# EAGLE design lc3dimmer_comm12V (EAGLE 5.04)
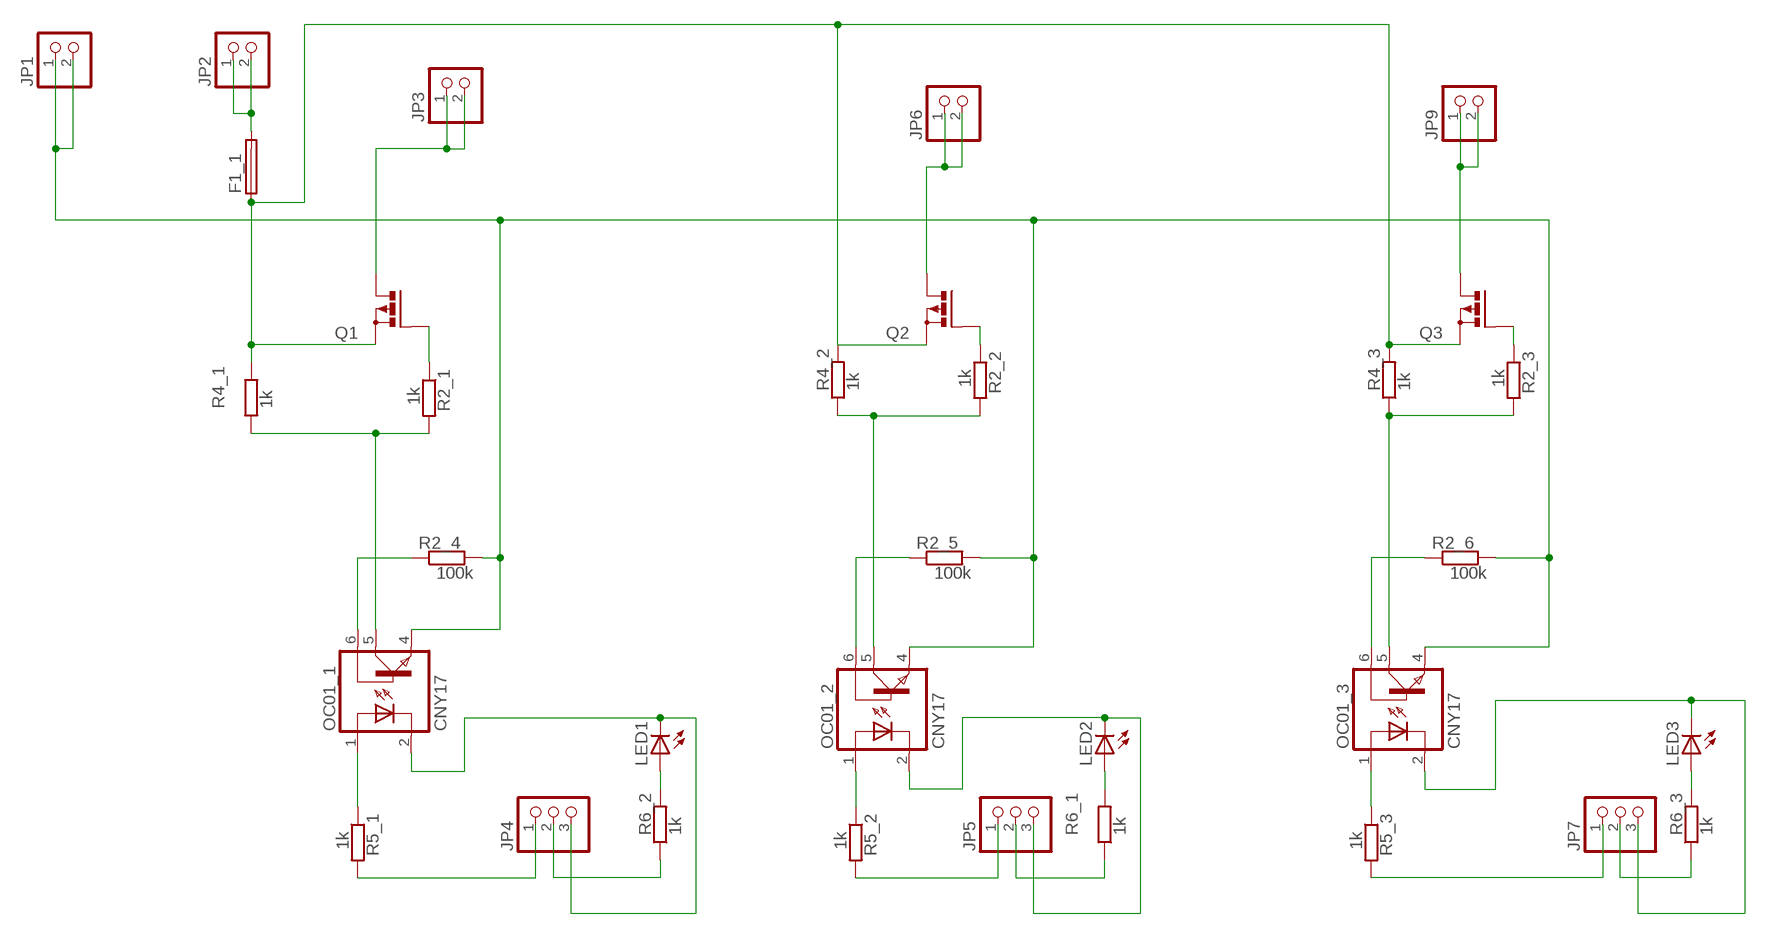
[diagram p0: schematic, sheet 1]

## Parts
F1_1  F457REICHELT  [PTF50]
JP1  PINHD-1X2  [1X02]
JP2  PINHD-1X2  [1X02]
JP3  PINHD-1X2  [1X02]
JP4  PINHD-1X3  [1X03]
JP5  PINHD-1X3  [1X03]
JP6  PINHD-1X2  [1X02]
JP7  PINHD-1X3  [1X03]
JP9  PINHD-1X2  [1X02]
LED1  LED3MM  [LED3MM]
LED2  LED3MM  [LED3MM]
LED3  LED3MM  [LED3MM]
OC01_1  CNY17  [DIL06]
OC01_2  CNY17  [DIL06]
OC01_3  CNY17  [DIL06]
Q1  PMOSFET_PTO220BV  [TO220BV]
Q2  PMOSFET_PTO220BV  [TO220BV]
Q3  PMOSFET_PTO220BV  [TO220BV]
R2_1  1k  R-EU_0207/10  [0207/10]
R2_2  1k  R-EU_0207/10  [0207/10]
R2_3  1k  R-EU_0207/10  [0207/10]
R2_4  100k  R-EU_0207/10  [0207/10]
R2_5  100k  R-EU_0207/10  [0207/10]
R2_6  100k  R-EU_0207/10  [0207/10]
R4_1  1k  R-EU_0207/10  [0207/10]
R4_2  1k  R-EU_0207/10  [0207/10]
R4_3  1k  R-EU_0207/10  [0207/10]
R5_1  1k  R-EU_R1206  [R1206]
R5_2  1k  R-EU_R1206  [R1206]
R5_3  1k  R-EU_R1206  [R1206]
R6_1  1k  R-EU_R1206  [R1206]
R6_2  1k  R-EU_R1206  [R1206]
R6_3  1k  R-EU_R1206  [R1206]

## Nets
12V+: F1_1.2 JP2.1 JP2.2
DIMMGND: JP3.1 JP3.2 Q1.D
GND: JP7.3 LED3.K(C) OC01_3.2(C)
LED+: F1_1.1 Q1.S Q2.S Q3.S R4_1.2 R4_2.2 R4_3.2
LED-: JP1.1 JP1.2 OC01_1.4(EMI) OC01_2.4(EMI) OC01_3.4(EMI) R2_4.2 R2_5.2 R2_6.2
N$1: OC01_1.6(BAS) R2_4.1
N$2: OC01_2.5(COL) R2_2.2 R4_2.1
N$3: OC01_1.5(COL) R2_1.2 R4_1.1
N$4: OC01_2.1(A) R5_2.1
N$5: Q1.G R2_1.1
N$6: Q2.G R2_2.1
N$7: OC01_3.5(COL) R2_3.2 R4_3.1
N$8: Q3.G R2_3.1
N$9: OC01_2.6(BAS) R2_5.1
N$10: OC01_3.6(BAS) R2_6.1
N$12: JP6.1 JP6.2 Q2.D
N$14: OC01_3.1(A) R5_3.1
N$23: JP9.1 JP9.2 Q3.D
N$24: LED1.A R6_2.2
N$25: LED2.A R6_1.2
N$26: JP4.2 R6_2.1
N$27: LED3.A R6_3.2
N$28: JP4.1 R5_1.2
N$29: JP5.1 R5_2.2
N$30: JP7.2 R6_3.1
N$31: JP5.3 LED2.K(C) OC01_2.2(C)
N$32: JP5.2 R6_1.1
N$33: JP7.1 R5_3.2
N$34: JP4.3 LED1.K(C) OC01_1.2(C)
N$37: OC01_1.1(A) R5_1.1

## Library data of the parts
F1_1 = fuse:F457: FUSE HOLDER CS, Schukat
JP1-JP3 JP6 JP9 = pinhead:PINHD-1X2: PIN HEADER
JP4 JP5 JP7 = pinhead:PINHD-1X3: PIN HEADER
LED1-LED3 = led:LED: LED OSRAM: - CHIPLED LG R971, LG N971, LY N971, LG Q971, LY Q971, LO R971, LY R971 LH N974, LH R974 LS Q976, LO Q976, LY Q976 LO Q996 - Hyper CHIPLED LW Q18S LB Q993, LB Q99A, LB R99A - SideLED LS A670, LO A670, LY A670, LG A670, LP A670 LB A673, LV A673, LT A673, LW A673 LH A674 LY A675 LS A676, LA A676, LO A676, LY A676, LW A676 LS A679, LY A679, LG A679 - Hyper Micro SIDELED® LS Y876, LA Y876, LO Y876, LY Y876 LT Y87S - SmartLED LW L88C, LW L88S LB L89C, LB L89S, LG L890 LS L89K, LO L89K, LY L89K LS L896, LA L896, LO L896, LY L896 - TOPLED LS T670, LO T670, LY T670, LG T670, LP T670 LSG T670, LSP T670, LSY T670, LOP T670, LYG T670 LG T671, LOG T671, LSG T671 LB T673, LV T673, LT T673, LW T673 LH T674 LS T676, LA T676, LO T676, LY T676, LB T676, LH T676, LSB T676, LW T676 LB T67C, LV T67C, LT T67C, LS T67K, LO T67K, LY T67K, LW E67C LS E67B, LA E67B, LO E67B, LY E67B, LB E67C, LV E67C, LT E67C LW T67C LS T679, LY T679, LG T679 LS T770, LO T770, LY T770, LG T770, LP T770 LB T773, LV T773, LT T773, LW T773 LH T774 LS E675, LA E675, LY E675, LS T675 LS T776, LA T776, LO T776, LY T776, LB T776 LHGB T686 LT T68C, LB T68C - Hyper Mini TOPLED® LB M676 - Mini TOPLED Santana® LG M470 LS M47K, LO M47K, LY M47K Source: http://www.osram.convergy.de - LUMILED® LXK2-PW12-R00, LXK2-PW12-S00, LXK2-PW14-U00, LXK2-PW14-V00 LXK2-PM12-R00, LXK2-PM12-S00, LXK2-PM14-U00 LXK2-PE12-Q00, LXK2-PE12-R00, LXK2-PE12-S00, LXK2-PE14-T00, LXK2-PE14-U00 LXK2-PB12-K00, LXK2-PB12-L00, LXK2-PB12-M00, LXK2-PB14-N00, LXK2-PB14-P00, LXK2-PB14-Q00 LXK2-PR12-L00, LXK2-PR12-M00, LXK2-PR14-Q00, LXK2-PR14-R00 LXK2-PD12-Q00, LXK2-PD12-R00, LXK2-PD12-S00 LXK2-PH12-R00, LXK2-PH12-S00 LXK2-PL12-P00, LXK2-PL12-Q00, LXK2-PL12-R00 Source: www.luxeon.com
OC01_1-OC01_3 = optocoupler:CNY17: SIEMENS OPTO COUPLER
Q1-Q3 = transistor-power:PMOSFET_P: Power MOSFET P-Channel
R2_1-R2_6 R4_1-R4_3 R5_1-R5_3 R6_1-R6_3 = rcl:R-EU_: RESISTOR, European symbol

## Board
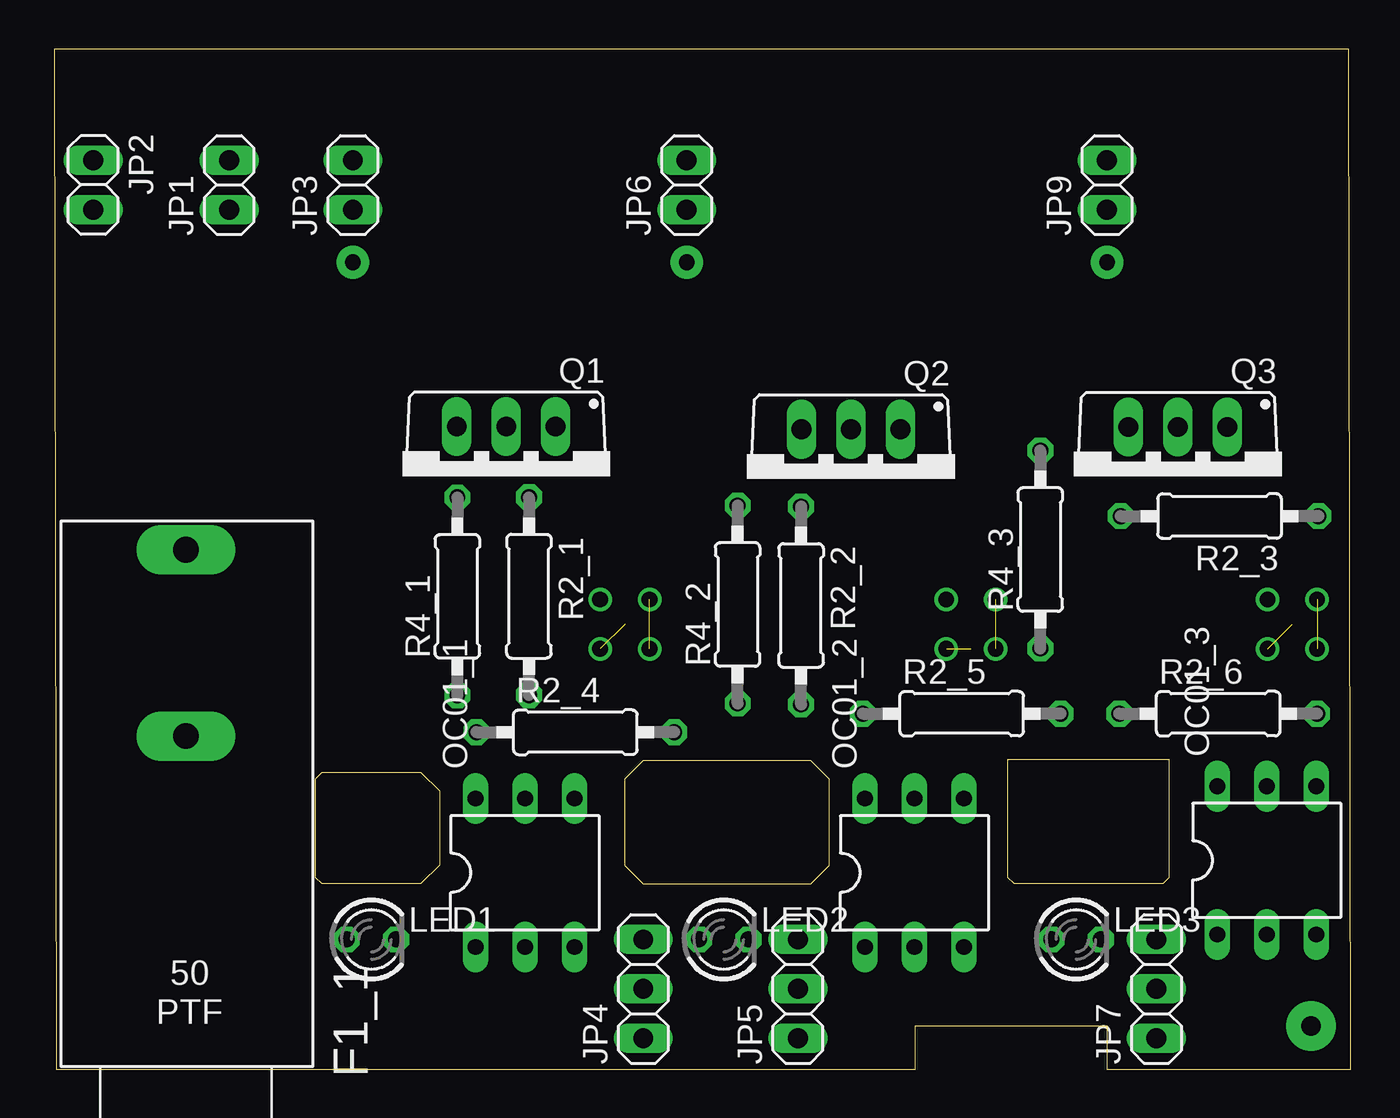
[diagram p1: board, top side]
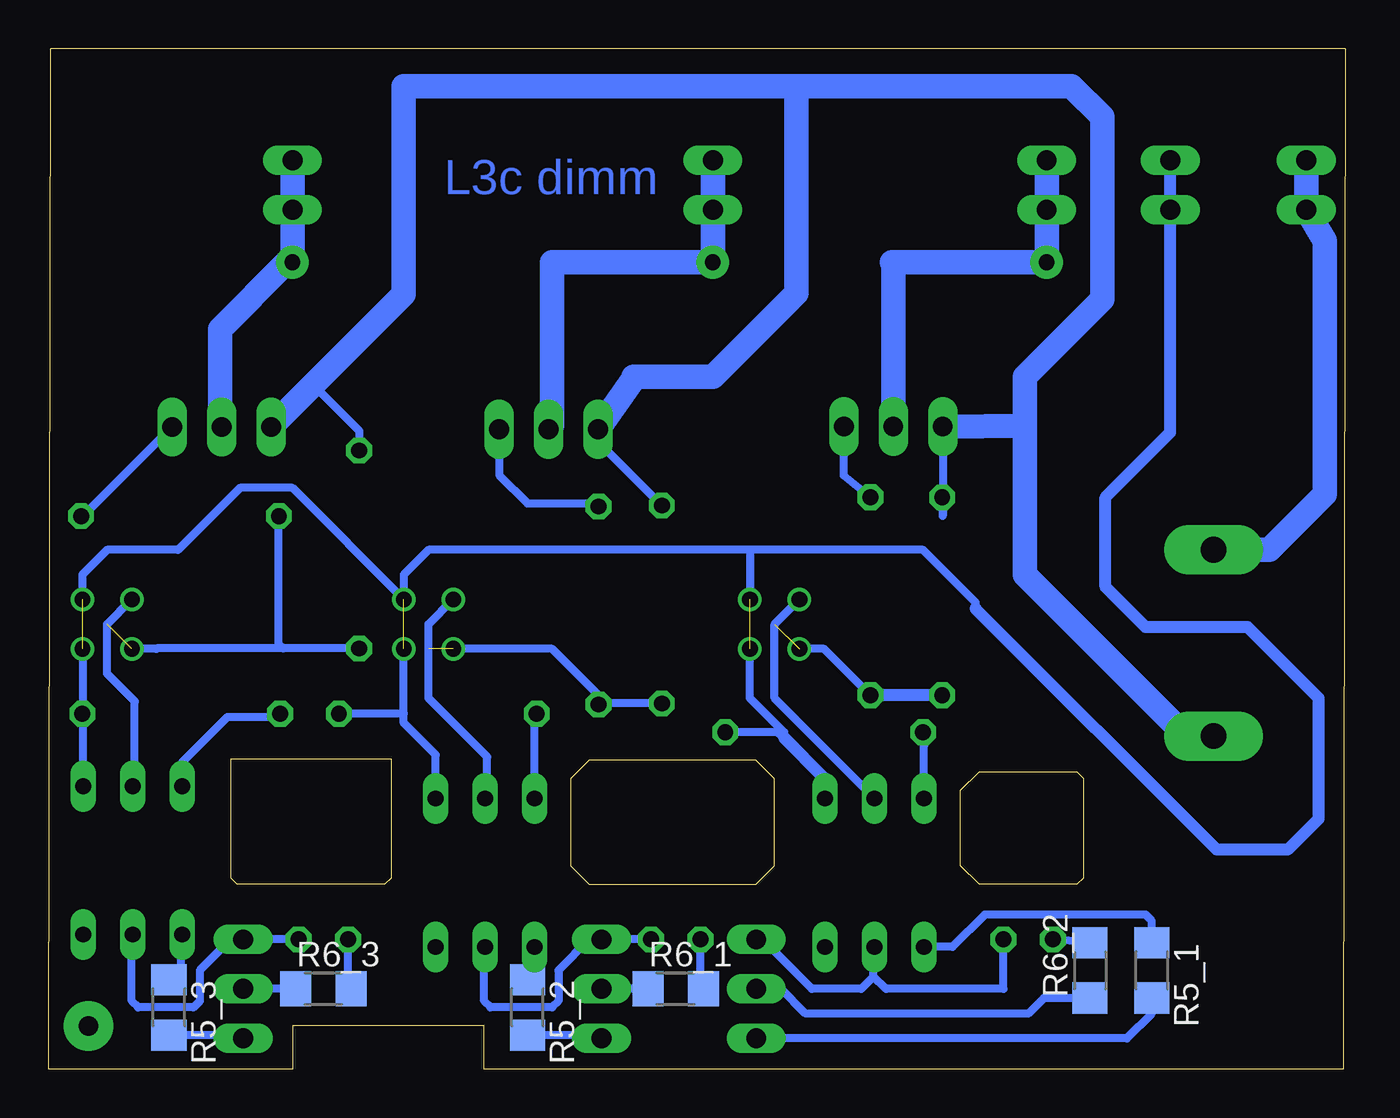
[diagram p2: board, bottom side, seen from below]

Size 66.6 x 52.4 mm. Coordinates in mm from the lower left corner, seen from the top.
Outline: 0.1,0 44.23,0 44.23,2.22 54.08,2.22 54.08,0 66.6,0 66.5,52.4 0,52.4 0.1,0
Outline: 49,9.84 49,15.91 57.25,15.91 57.25,9.84 56.93,9.53 49.31,9.53 49,9.84
Outline: 29.31,14.92 30.26,15.88 38.84,15.88 39.79,14.92 39.79,10.44 38.84,9.49 30.26,9.49 29.31,10.44 29.31,14.92
Outline: 13.75,15.24 18.83,15.24 19.79,14.29 19.79,10.48 18.83,9.53 13.75,9.53 13.44,9.84 13.44,14.92 13.75,15.24
Copper layers (1*16): Top 0.035mm / dielectric 1.5mm / Bottom 0.035mm
Design rules "default": minimum track width 10mil, minimum drill 24mil, track to track 8mil, track to pad 8mil, pad to pad 8mil, via to via 8mil, smd to smd 8mil, copper to edge 40mil, drill to drill 8mil, minimum pad ring 10mil, minimum via ring 8mil, stop-mask expansion 4mil, vias tented up to drill 0mil, thermal gap 10mil
bRestrict: area 4,37.4 to 7,40.4

### Footprints (pad centres in the part's own frame; a part is rotated, then mirrored left to right if it is on the bottom)
PTF50 = drill 1.321 pad 2.54 long: 1 -4.48,0; 2 5.08,0
1X02 = drill 1.016 long: 1 -1.27,0; 2 1.27,0
1X03 = drill 1.016 long: 1 -2.54,0; 2 0,0; 3 2.54,0
LED3MM = drill 0.813 octagon: A -1.27,0; K 1.27,0
DIL06 = drill 0.813 long: 1 -2.54,-3.81; 2 0,-3.81; 3 2.54,-3.81; 4 2.54,3.81; 5 0,3.81; 6 -2.54,3.81
TO220BV = drill 1.016 long: D 0,-2.54; G -2.54,-2.54; S 2.54,-2.54
0207/10 = drill 0.813 octagon: 1 -5.08,0; 2 5.08,0
R1206 = smd 1.6 x 1.803: 1 -1.422,0; 2 1.422,0

### Placement (x,y rotation side)
F1_1  6.77,21.59 90 top
JP1  8.99,45.4 90 top
JP2  2,45.4 270 top
JP3  15.34,45.4 90 top
JP4  30.26,4.13 90 top
JP5  38.2,4.13 90 top
JP6  32.48,45.4 90 top
JP7  56.62,4.13 90 top
JP9  54.08,45.4 90 top
LED1  16.29,6.67 0 top
LED2  34.39,6.67 0 top
LED3  52.49,6.67 0 top
OC01_1  24.18,10.09 0 top
OC01_2  44.19,10.09 0 top
OC01_3  62.28,10.73 0 top
Q1  23.22,30.46 180 top
Q2  40.92,30.32 180 top
Q3  57.72,30.44 180 top
R2_1  24.39,24.29 270 top
R2_2  38.36,23.81 270 top
R2_3  59.86,28.4 180 top
R2_4  26.77,17.3 0 top
R2_5  46.61,18.26 0 top
R2_6  59.79,18.26 0 top
R4_1  20.71,24.28 90 top
R4_2  35.1,23.86 90 top
R4_3  50.65,26.69 90 top
R5_1  9.94,5.08 270 bottom
R5_2  42.01,3.17 270 bottom
R5_3  60.43,3.17 270 bottom
R6_1  34.39,4.13 0 bottom
R6_2  13.12,5.08 90 bottom
R6_3  52.49,4.13 0 bottom

### Tracks (layer width: path | path; a pad name or v marks a point on that pad's centre or on a via)
12V+
  Bottom 1.27: F1_1.2 3.91,26.67 1.05,29.53 1.05,42.55 JP2.2 JP2.1
DIMMGND  (via drill 0.8 pad 1.68)
  Bottom 1.27: JP3.2 JP3.1 v15.34,41.43 23.22,41.43 | 23.22,41.43 23.28,41.43 | Q1.D 23.22,41.43
GND
  Bottom 0.406: LED3.K JP7.3 57.25,6.67 58.84,5.08 58.84,3.49 59.16,3.17 62.01,3.17 62.33,3.49 62.33,6.23 OC01_3.2
LED+
  Bottom 0.406: R4_1.2 20.68,28.41 Q1.S | Q2.S 38.38,32.22 R4_2.2 | R4_3.2 50.65,32.77 53.02,35.14
  Bottom 1.27: 28.2,50.32 28.2,39.85 | 28.2,50.32 28.2,50.48 48.36,50.48 48.36,39.8 53.02,35.14 Q3.S | 28.2,39.85 | 28.2,39.85 32.48,35.56 36.48,35.56 | 16.45,33.05 16.45,35.56 12.48,39.53 12.48,48.9 14.07,50.48 28.04,50.48 28.2,50.32 | F1_1.1 8.16,17.11 16.45,25.4 16.45,33.05 | 16.45,33.05 Q1.S | 36.48,35.56 36.55,35.56 | 36.48,35.56 Q2.S
LED-  (3 unrouted)
  Bottom 0.406: OC01_3.4 64.82,18.1 | 64.82,18.1 64.82,21.54 64.87,21.59 | 64.87,24.13 64.87,25.4 63.6,26.67 59.95,26.67 56.77,29.84 54.08,29.84 48.36,24.13 48.36,25.4 47.09,26.67 30.58,26.67 | OC01_2.4 46.73,16.14 48.36,17.78 48.36,18.26 | 48.36,18.26 48.36,21.59 | 30.58,21.59 30.58,19.05 28.83,17.3 28.83,17.04 29.2,17.3 R2_4.2 | 18.99,23.65 18.99,23.97 21.69,26.67 30.58,26.67 | 30.58,26.67 30.58,24.13 | 48.36,18.26 R2_5.2 | R2_6.2 64.87,18.14 64.82,18.1
  Bottom 0.61: 9.15,46.67 JP1.2 JP1.1 8.99,32.7 12.32,29.37 12.32,24.77 10.26,22.7 5.02,22.7 1.37,19.05 1.37,12.86 2.96,11.27 6.61,11.27 18.99,23.65 | 26.61,13.79 OC01_1.4 26.72,14.93 28.83,17.04
N$1
  Bottom 0.406: OC01_1.6 21.64,16.62 R2_4.1
N$2  (1 unrouted)
  Bottom 0.406: 44.07,14.01 44.07,16.03 47.09,19.05 47.09,22.86 45.82,24.13 | R4_2.1 38.31,18.78 R2_2.2 38.36,19.21 40.74,21.59 45.82,21.59
  Bottom 0.61: OC01_2.5 44.07,14.01
N$3  (1 unrouted)
  Bottom 0.406: OC01_1.5 24.18,13.92 29.31,19.05 29.31,22.86 28.04,24.13 | R2_1.2 26.77,21.59 28.04,21.59
  Bottom 0.61: R2_1.2 21.82,19.21 R4_1.1
N$4
  Bottom 0.406: OC01_2.1 41.65,4.96 R5_2.1
N$5
  Bottom 0.406: R2_1.1 25.76,30.48 Q1.G
N$6
  Bottom 0.406: Q2.G 43.46,30.5 42.01,29.05 38.52,29.05 R2_2.1
N$7  (1 unrouted)
  Bottom 0.406: 62.17,14.65 62.17,18.89 63.6,20.32 63.6,22.86 62.33,24.13 | 62.33,21.59 61.06,21.59 61.04,21.61 54.55,21.61 | R4_3.1 54.55,21.61 | R2_3.2 54.77,21.83 54.55,21.61
  Bottom 0.61: OC01_3.5 62.17,14.65
N$8
  Bottom 0.406: R2_3.1 64.84,28.4 Q3.G
N$9
  Bottom 0.406: OC01_2.6 41.65,18.14 R2_5.1
N$10
  Bottom 0.406: OC01_3.6 59.74,15.76 57.41,18.1 54.87,18.1 R2_6.1
N$12  (via drill 0.8 pad 1.68)
  Bottom 1.27: JP6.2 JP6.1 v32.48,41.43 40.74,41.43 40.74,33.04 Q2.D
N$13  (via drill 0.8)
  other vias: 62.33,21.59
N$14
  Bottom 0.406: R5_3.1 59.79,5.28 OC01_3.1
N$15  (via drill 0.8)
  other vias: 62.33,24.13
N$16  (via drill 0.8)
  other vias: 64.87,24.13
N$17  (via drill 1 pad 2.54)
  other vias: 64.55,2.22
N$18  (via drill 0.8)
  other vias: 64.87,21.59
N$19  (via drill 0.8)
  other vias: 45.82,21.59
N$20  (via drill 0.8)
  other vias: 48.36,21.59
N$21  (via drill 0.8)
  other vias: 48.36,24.13
N$22  (via drill 0.8)
  other vias: 45.82,24.13
N$23  (via drill 0.8 pad 1.68)
  Bottom 1.27: JP9.2 JP9.1 v54.08,41.43 54.37,41.43 57.8,38 57.8,33.06 Q3.D
N$24
  Bottom 0.406: R6_2.2 LED1.A
N$25
  Bottom 0.406: LED2.A 33.12,4.28 R6_1.2
N$26
  Bottom 0.406: R6_2.1 15.49,3.66 16.29,2.86 27.72,2.86 28.99,4.13 JP4.2
N$27
  Bottom 0.406: LED3.A 51.22,4.28 R6_3.2
N$28
  Bottom 0.406: R5_1.2 9.94,2.86 11.21,1.59 JP4.1
N$29
  Bottom 0.406: R5_2.2 38.99,1.75 JP5.1
N$30
  Bottom 0.406: R6_3.1 JP7.2
N$31
  Bottom 0.406: LED2.K JP5.3 38.84,6.67 40.42,5.08 40.42,3.49 40.74,3.17 43.91,3.17 44.23,3.49 44.23,5.6 OC01_2.2
N$32
  Bottom 0.406: 35.81,3.66 R6_1.1 JP5.2
N$33
  Bottom 0.406: R5_3.2 57.08,1.75 JP7.1
N$34
  Bottom 0.406: LED1.K 17.56,4.13 23.6,4.13 24.23,4.76 | 24.23,4.76 24.23,6.23 OC01_1.2 | JP4.3 29.95,6.67 27.41,4.13 24.87,4.13 24.23,4.76
N$35  (via drill 0.8)
  other vias: 28.04,21.59
N$36  (via drill 0.8)
  other vias: 30.58,21.59
N$37
  Bottom 0.406: OC01_1.1 20.17,6.28 18.52,7.94 10.26,7.94 9.94,7.62 R5_1.1
N$38  (via drill 0.8)
  other vias: 30.58,24.13
N$39  (via drill 0.8)
  other vias: 28.04,24.13

### Text on the board
Bottom: L3c dimm